# EAGLE design avr-grundschaltung (EAGLE 4.16)
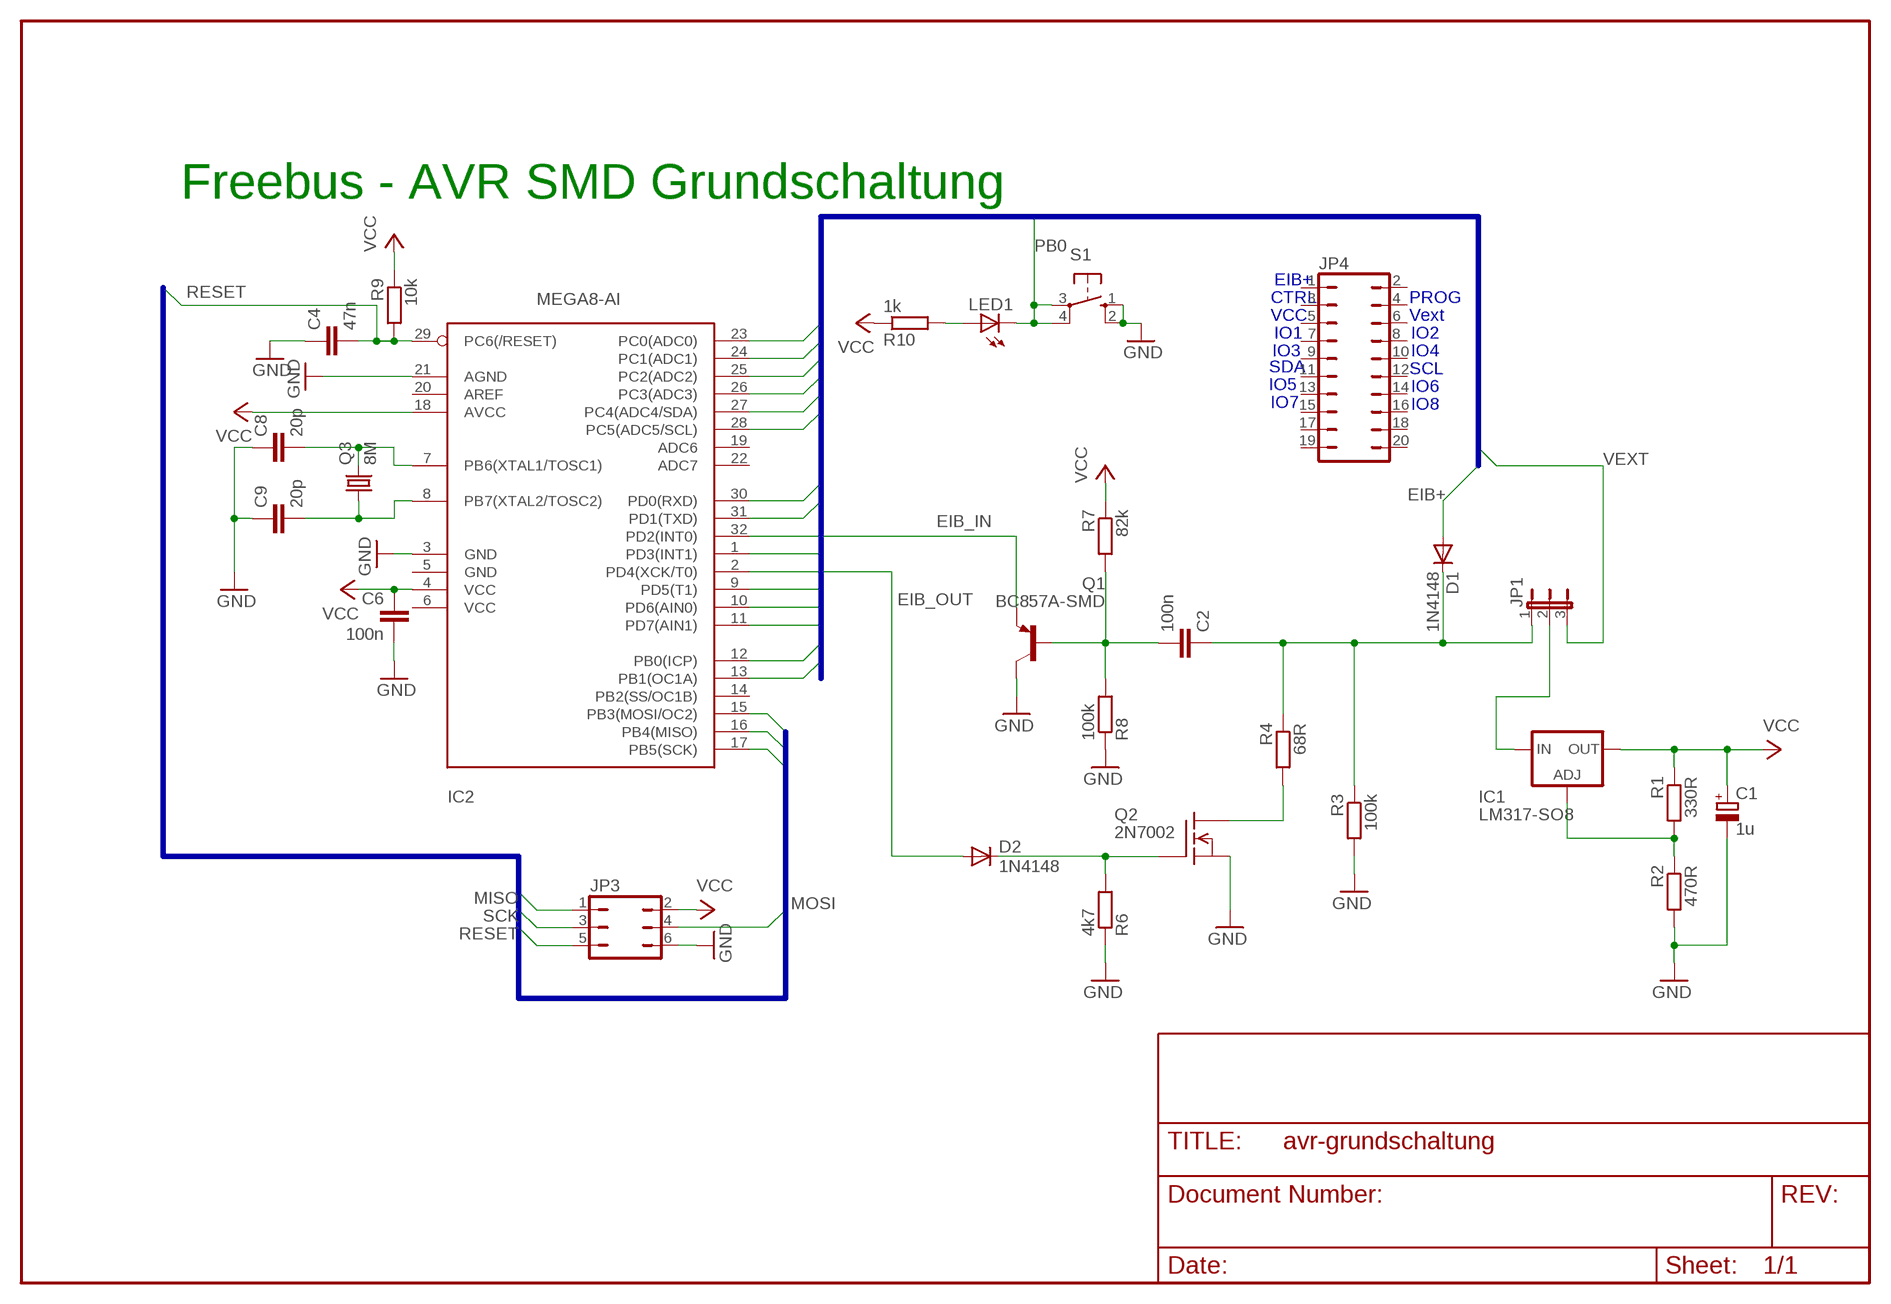
[diagram p0: schematic, sheet 1]

## Parts
C1  1u  CPOL-EUSMCB  [SMC_B]
C2  100n  C-EUC1206  [C1206]
C4  47n  C-EUC1206  [C1206]
C6  100n  C-EUC1206  [C1206]
C8  20p  C-EUC1206  [C1206]
C9  20p  C-EUC1206  [C1206]
D1  1N4148  DIODE-SOD80C  [SOD80C]
D2  1N4148  DIODE-SOD80C  [SOD80C]
IC1  LM317-SO8  [SO-8]
IC2  MEGA8-AI  [TQFP32-08]
JP1  JP2E  [JP2]
JP3  JP3Q  [JP3Q]
JP4  JP10Q  [JP10Q]
LED1  LEDP-LCC-2  [P-LCC-2]
Q1  BC857A-SMD  BC857A-PNP-SOT23-BEC  [SOT23-BEC]
Q2  2N7002  [SOT23]
Q3  8M  CRYSTALHC49UP  [HC49UP]
R1  330R  R-EU_R0805  [R0805]
R2  470R  R-EU_R0805  [R0805]
R3  100k  R-EU_R0805  [R0805]
R4  68R  R-EU_R0805  [R0805]
R6  4k7  R-EU_R0805  [R0805]
R7  82k  R-EU_R0805  [R0805]
R8  100k  R-EU_R0805  [R0805]
R9  10k  R-EU_M0805  [M0805]
R10  1k  R-EU_R0805  [R0805]
S1  10-XX  [B3F-10XX]

## Nets
EIB+: D1.A
EIB_IN: IC2.32(PD2(INT0)) Q1.E
EIB_OUT: D2.A IC2.2(PD4(XCK/T0))
GND [supply]: C1.- C4.1 C6.2 C8.1 C9.1 IC2.3(GND) IC2.21(AGND) JP3.6 Q1.C Q2.2(S) R2.2 R3.2 R6.1 R8.1 S1.1(S) S1.2(S1)
MISO: IC2.16(PB4(MISO)) JP3.1
MOSI: IC2.15(PB3(MOSI/OC2)) JP3.4
N$2: IC1.4(ADJ) R1.2 R2.1
N$3 [supply]: C2.1 D1.C JP1.1 R3.1 R4.1
N$4: LED1.A R10.2
N$5 [supply]: Q2.3(D) R4.2
N$6 [supply]: IC1.1(IN) JP1.2
N$7 [supply]: C2.2 Q1.B R7.2 R8.2
N$8: C8.2 IC2.7(PB6(XTAL1/TOSC1)) Q3.2
N$9: C9.2 IC2.8(PB7(XTAL2/TOSC2)) Q3.1
N$12: D2.C Q2.1(G) R6.2
OC1A/PWM1: IC2.13(PB1(OC1A))
PB0: IC2.12(PB0(ICP)) LED1.C S1.3(P) S1.4(P1)
PC0/ADC0: IC2.23(PC0(ADC0))
PC1/ADC1: IC2.24(PC1(ADC1))
PC2/ADC2: IC2.25(PC2(ADC2))
PC3/ADC3: IC2.26(PC3(ADC3))
PC4/ADC4/SDA: IC2.27(PC4(ADC4/SDA))
PC5/ADC5/SCL: IC2.28(PC5(ADC5/SCL))
PD0/RXD: IC2.30(PD0(RXD))
PD1/TXD: IC2.31(PD1(TXD))
PD3/INT1: IC2.1(PD3(INT1))
PD5/T1: IC2.9(PD5(T1))
PD6/AIN0: IC2.10(PD6(AIN0))
PD7/AIN1: IC2.11(PD7(AIN1))
RESET: C4.2 IC2.29(PC6(/RESET)) JP3.5 R9.2
SCK: IC2.17(PB5(SCK)) JP3.3
VCC: C1.+ C6.1 IC1.6(OUT) IC2.4(VCC) IC2.18(AVCC) JP3.2 R1.1 R7.1 R9.1 R10.1
VEXT [supply]: JP1.3
Unconnected: IC1.2(OUT) IC1.3(OUT) IC1.5(NC) IC1.7(OUT) IC1.8(NC) IC2.5(GND) IC2.6(VCC) IC2.14(PB2(SS/OC1B)) IC2.19(ADC6) IC2.20(AREF) IC2.22(ADC7) JP4.1 JP4.2 JP4.3 JP4.4 JP4.5 JP4.6 JP4.7 JP4.8 JP4.9 JP4.10 JP4.11 JP4.12 JP4.13 JP4.14 JP4.15 JP4.16 JP4.17 JP4.18 JP4.19 JP4.20

## Buses
PC0/ADC0,PC1/ADC1,PC2/ADC2,PC3/ADC3,PC4/ADC4/SDA,PC5/ADC5/SCL,PD0/RXD,PD1/TXD,EIB+,PB1/OC1A/PWM1,PB2/OC1B/PWM2,VEXT,PB0,VCC,PD3/INT1,PD5/T1,PD6/AIN0,PD7/AIN1
MOSI,MISO,SCK,RESET

## Notes on the sheet
- Freebus - AVR SMD Grundschaltung
- EIB+
- CTRL | PROG
- VCC | Vext
- IO1 | IO2
- IO3 | IO4
- SDA | SCL
- IO5 | IO6
- IO7 | IO8

## Library data of the parts
C1 = rcl:CPOL-EU: POLARIZED CAPACITOR, European symbol
C2 C4 C6 C8 C9 = rcl:C-EU: CAPACITOR, European symbol
D1 D2 = diode:DIODE-: DIODE
IC1 = freebus:LM317-SO8
IC2 = atmel:MEGA8: MICROCONTROLLER 8 Kbytes FLASH 1 kbytes SRAM 512 bytes EEPROM USART 6-channel 10 bit ADC 2-channel 8 bit ADC Source: avr.lbr
JP1 = jumper:JP2E: JUMPER
JP3 = jumper:JP3Q: JUMPER
JP4 = jumper:JP10Q: JUMPER
LED1 = led:LED: LED OSRAM: - CHIPLED LG R971, LG N971, LY N971, LG Q971, LY Q971, LO R971, LY R971 LH N974, LH R974 LS Q976, LO Q976, LY Q976 LO Q996 - Hyper CHIPLED LW Q18S LB Q993, LB Q99A, LB R99A - SideLED LS A670, LO A670, LY A670, LG A670, LP A670 LB A673, LV A673, LT A673, LW A673 LH A674 LY A675 LS A676, LA A676, LO A676, LY A676, LW A676 LS A679, LY A679, LG A679 - Hyper Micro SIDELED® LS Y876, LA Y876, LO Y876, LY Y876 LT Y87S - SmartLED LW L88C, LW L88S LB L89C, LB L89S, LG L890 LS L89K, LO L89K, LY L89K LS L896, LA L896, LO L896, LY L896 - TOPLED LS T670, LO T670, LY T670, LG T670, LP T670 LSG T670, LSP T670, LSY T670, LOP T670, LYG T670 LG T671, LOG T671, LSG T671 LB T673, LV T673, LT T673, LW T673 LH T674 LS T676, LA T676, LO T676, LY T676, LB T676, LH T676, LSB T676, LW T676 LB T67C, LV T67C, LT T67C, LS T67K, LO T67K, LY T67K, LW E67C LS E67B, LA E67B, LO E67B, LY E67B, LB E67C, LV E67C, LT E67C LW T67C LS T679, LY T679, LG T679 LS T770, LO T770, LY T770, LG T770, LP T770 LB T773, LV T773, LT T773, LW T773 LH T774 LS E675, LA E675, LY E675, LS T675 LS T776, LA T776, LO T776, LY T776, LB T776 LHGB T686 LT T68C, LB T68C - Hyper Mini TOPLED® LB M676 - Mini TOPLED Santana® LG M470 LS M47K, LO M47K, LY M47K Source: http://www.osram.convergy.de - LUMILED® LXK2-PW12-R00, LXK2-PW12-S00, LXK2-PW14-U00, LXK2-PW14-V00 LXK2-PM12-R00, LXK2-PM12-S00, LXK2-PM14-U00 LXK2-PE12-Q00, LXK2-PE12-R00, LXK2-PE12-S00, LXK2-PE14-T00, LXK2-PE14-U00 LXK2-PB12-K00, LXK2-PB12-L00, LXK2-PB12-M00, LXK2-PB14-N00, LXK2-PB14-P00, LXK2-PB14-Q00 LXK2-PR12-L00, LXK2-PR12-M00, LXK2-PR14-Q00, LXK2-PR14-R00 LXK2-PD12-Q00, LXK2-PD12-R00, LXK2-PD12-S00 LXK2-PH12-R00, LXK2-PH12-S00 LXK2-PL12-P00, LXK2-PL12-Q00, LXK2-PL12-R00 Source: www.luxeon.com
Q1 = transistor:*-PNP-: PNP Transistror
Q2 = freebus:2N7002
Q3 = crystal:CRYSTAL: CRYSTAL
R1-R4 R6-R10 = rcl:R-EU_: RESISTOR, European symbol
S1 = switch-omron:10-XX: OMRON SWITCH

## Board
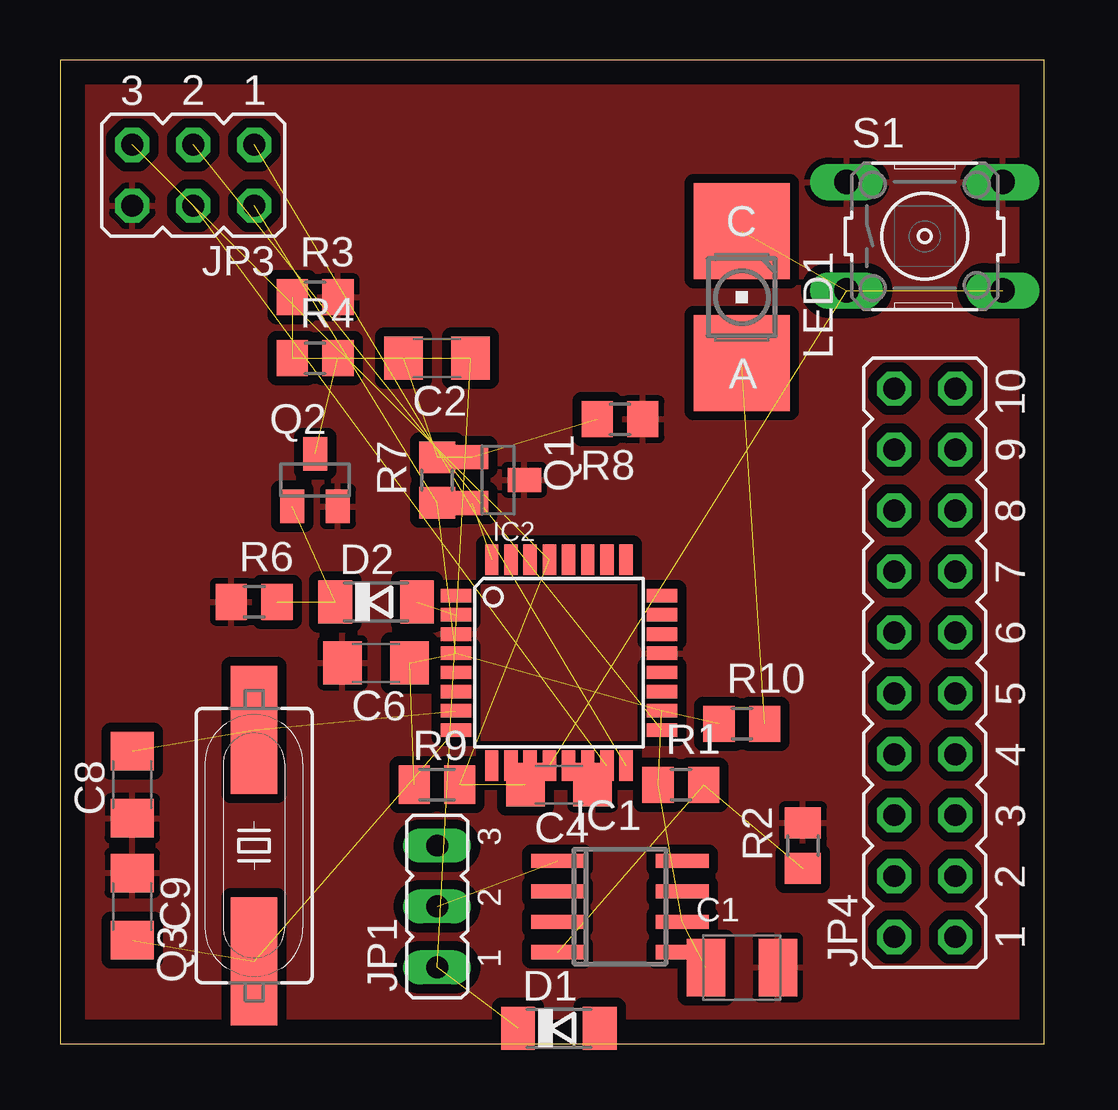
[diagram p1: board, top side]
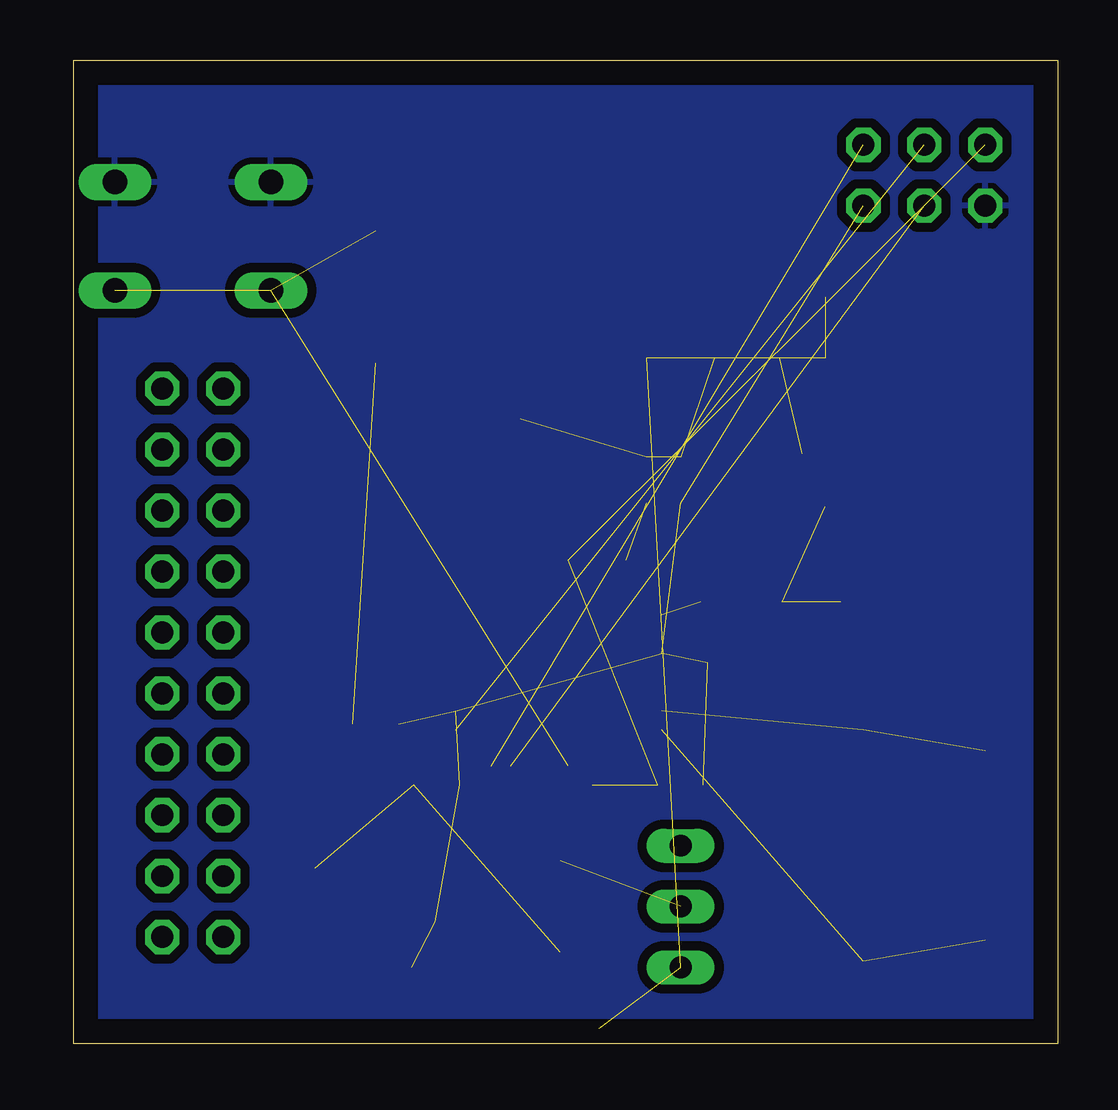
[diagram p2: board, bottom side, seen from below]

Size 41 x 41 mm. Coordinates in mm from the lower left corner, seen from the top.
Outline: 0,0 41,0 41,41 0,41 0,0
Copper layers (1*16): Top 0.035mm / dielectric 1.5mm / Bottom 0.035mm
Design rules "default": minimum track width 10mil, minimum drill 24mil, track to track 15mil, track to pad 10mil, pad to pad 8mil, via to via 8mil, smd to smd 10mil, copper to edge 40mil, drill to drill 8mil, minimum pad ring 10mil, minimum via ring 8mil, stop-mask expansion 4mil, vias tented up to drill 0mil, thermal gap 10mil

### Footprints (pad centres in the part's own frame; a part is rotated, then mirrored left to right if it is on the bottom)
SMC_B = smd 1.6 x 2.4: + -1.5,0; - 1.5,0
C1206 = smd 1.6 x 1.8: 1 -1.4,0; 2 1.4,0
SOD80C = smd 1.4 x 1.8: A 1.7,0; C -1.7,0
SO-8 = smd 0.6 x 2.2: 1 -1.905,-2.6; 2 -0.635,-2.6; 3 0.635,-2.6; 4 1.905,-2.6; 5 1.905,2.6; 6 0.635,2.6; 7 -0.635,2.6; 8 -1.905,2.6
TQFP32-08 = smd 1.27 x 0.559: 1 -4.293,2.8; 2 -4.293,2; 3 -4.293,1.2; 4 -4.293,0.4; 5 -4.293,-0.4; 6 -4.293,-1.2; 7 -4.293,-2; 8 -4.293,-2.8; 17 4.293,-2.8; 18 4.293,-2; 19 4.293,-1.2; 20 4.293,-0.4; 21 4.293,0.4; 22 4.293,1.2; 23 4.293,2; 24 4.293,2.8 | smd 0.559 x 1.27: 9 -2.8,-4.293; 10 -2,-4.293; 11 -1.2,-4.293; 12 -0.4,-4.293; 13 0.4,-4.293; 14 1.2,-4.293; 15 2,-4.293; 16 2.8,-4.293; 25 2.8,4.293; 26 2,4.293; 27 1.2,4.293; 28 0.4,4.293; 29 -0.4,4.293; 30 -1.2,4.293; 31 -2,4.293; 32 -2.8,4.293
JP2 = drill 0.914 long: 1 -2.54,0; 2 0,0; 3 2.54,0
JP3Q = drill 0.914 octagon: 1 -2.54,-1.27; 2 -2.54,1.27; 3 0,-1.27; 4 0,1.27; 5 2.54,-1.27; 6 2.54,1.27
JP10Q = drill 0.914 octagon: 1 -11.43,-1.27; 2 -11.43,1.27; 3 -8.89,-1.27; 4 -8.89,1.27; 5 -6.35,-1.27; 6 -6.35,1.27; 7 -3.81,-1.27; 8 -3.81,1.27; 9 -1.27,-1.27; 10 -1.27,1.27; 11 1.27,-1.27; 12 1.27,1.27; 13 3.81,-1.27; 14 3.81,1.27; 15 6.35,-1.27; 16 6.35,1.27; 17 8.89,-1.27; 18 8.89,1.27; 19 11.43,-1.27; 20 11.43,1.27
P-LCC-2 = smd 4 x 4: A 0,2.75; C 0,-2.75
SOT23-BEC = smd 1 x 1.4: B -0.95,-1.1; C 0,1.1; E 0.95,-1.1
SOT23 = smd 1 x 1.4: 1 -0.95,-1.1; 2 0.95,-1.1; 3 0,1.1
HC49UP = smd 5.334 x 1.93: 1 -4.826,0; 2 4.826,0
R0805 = smd 1.3 x 1.5: 1 -0.95,0; 2 0.95,0
M0805 = smd 1.3 x 1.6: 1 -0.95,0; 2 0.95,0
B3F-10XX = drill 1.016 long: 1 -3.251,2.261; 2 3.251,2.261; 3 -3.251,-2.261; 4 3.251,-2.261

### Placement (x,y rotation side)
C1  28.41,3.17 0 top
C2  15.71,28.57 180 top
C4  20.79,10.79 180 top
C6  13.17,15.87 180 top
C8  3.01,10.79 90 top
C9  3.01,5.71 270 top
D1  20.79,0.63 0 top
D2  13.17,18.41 0 top
IC1  23.33,5.71 270 top
IC2  20.79,15.87 0 top
JP1  15.71,5.71 90 top
JP3  5.55,36.19 180 top
JP4  36.03,15.87 90 top
LED1  28.41,31.11 180 top
Q1  18.25,23.49 270 top
Q2  10.63,23.49 0 top
Q3  8.09,8.25 90 top
R1  25.87,10.79 0 top
R2  30.95,8.25 90 top
R3  10.63,31.11 0 top
R4  10.63,28.57 0 top
R6  8.09,18.41 0 top
R7  15.71,23.49 90 top
R8  23.33,26.03 180 top
R9  15.71,10.79 0 top
R10  28.41,13.33 0 top
S1  36.03,33.65 0 top

### Tracks (layer width: path | path; a pad name or v marks a point on that pad's centre or on a via)
EIB_IN  (1 unrouted)
EIB_OUT  (1 unrouted)
GND
  pour Bottom: 0.22,40.76 40.86,40.76 40.86,0.12 0.22,0.12
  pour Top: 0.22,40.76 40.86,40.76 40.86,0.12 0.22,0.12
MISO  (1 unrouted)
MOSI  (1 unrouted)
N$2  (2 unrouted)
N$3  (4 unrouted)
N$4  (1 unrouted)
N$5  (1 unrouted)
N$6  (1 unrouted)
N$7  (3 unrouted)
N$8  (2 unrouted)
N$9  (2 unrouted)
N$12  (2 unrouted)
PB0  (3 unrouted)
RESET  (3 unrouted)
SCK  (1 unrouted)
VCC  (9 unrouted)